# Altium schematic sheet PCI long card 5V - 32 BIT.schdoc: PCI long card 5V - 32 BIT
size A; Organization: Organization; Address1: Address1; Address2: Address2; Address3: Address3; Address4: Address4; DocumentNumber: 1; Revision: 0; SheetNumber: 2; SheetTotal: 2
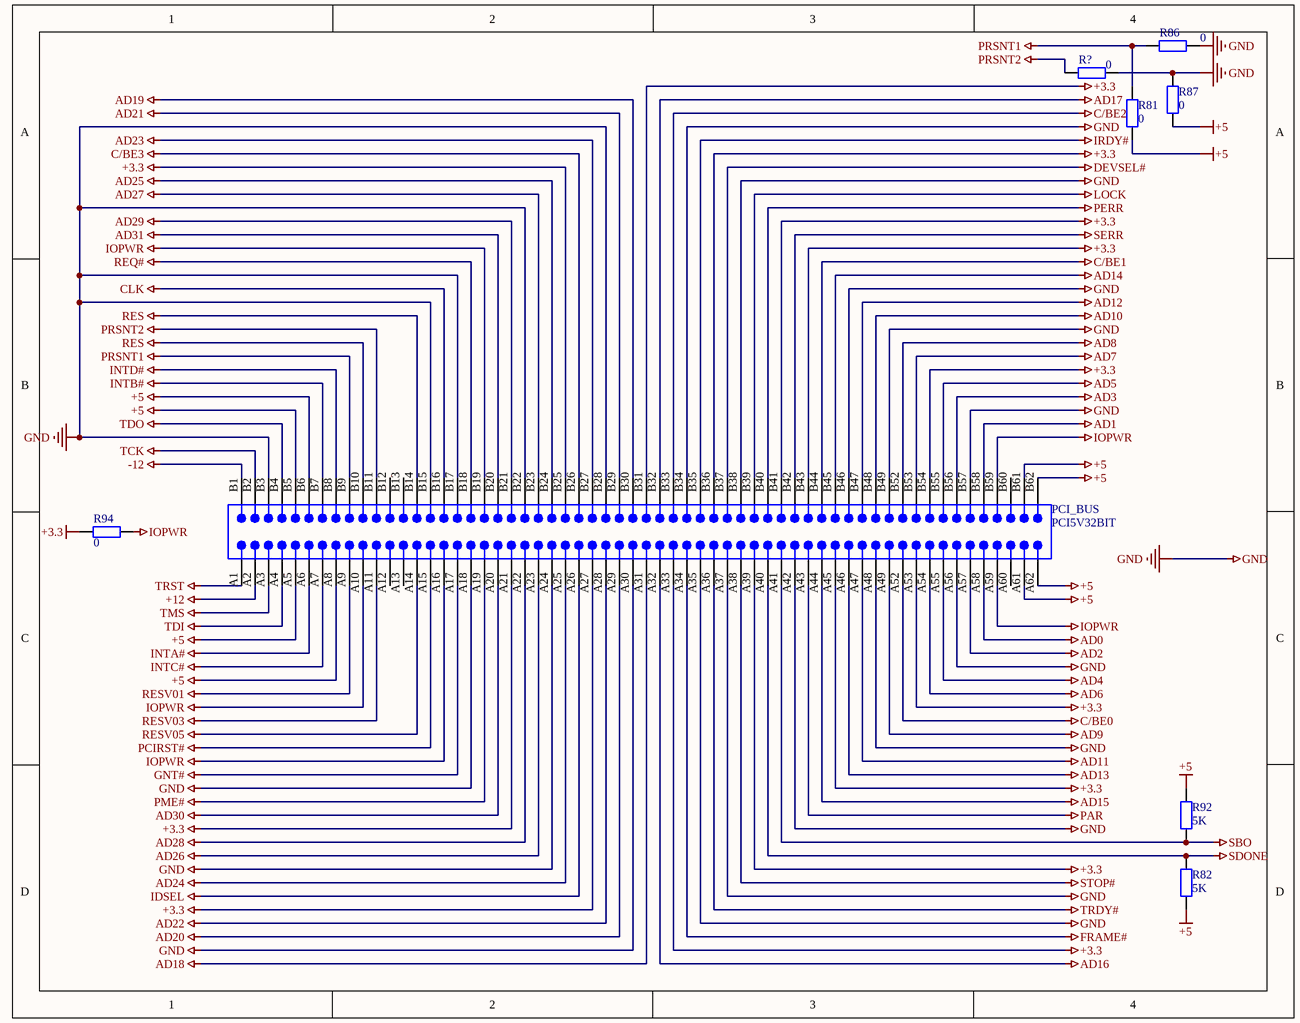
[diagram p0: PCI long card 5V - 32 BIT.schdoc]

## Parts
PCI_BUS  PCI5V32BIT  [PCI5V32BIT]
R81  value 0  [AXIAL-0.4]  (hidden comment: Res2)
R82  value 5K  [AXIAL-0.4]  (hidden comment: Res2)
R86  value 0  [AXIAL-0.4]  (hidden comment: Res2)
R87  value 0  [AXIAL-0.4]  (hidden comment: Res2)
R92  value 5K  [AXIAL-0.4]  (hidden comment: Res2)
R94  value 0  [AXIAL-0.4]  (hidden comment: Res2)
R?  value 0  [AXIAL-0.4]  (hidden comment: Res2)

## Nets
+3.3: PCI_BUS.A21 PCI_BUS.A27 PCI_BUS.A33 PCI_BUS.A39 PCI_BUS.A45 PCI_BUS.A53 PCI_BUS.B25 PCI_BUS.B31 PCI_BUS.B36 PCI_BUS.B41 PCI_BUS.B43 PCI_BUS.B54 R94.1
+5: PCI_BUS.A5 PCI_BUS.A8 PCI_BUS.A61 PCI_BUS.A62 PCI_BUS.B5 PCI_BUS.B6 PCI_BUS.B61 PCI_BUS.B62 R81.2 R82.2 R87.2 R92.1
+12: PCI_BUS.A2
-12: PCI_BUS.B1
AD0: PCI_BUS.A58
AD1: PCI_BUS.B58
AD2: PCI_BUS.A57
AD3: PCI_BUS.B56
AD4: PCI_BUS.A55
AD5: PCI_BUS.B55
AD6: PCI_BUS.A54
AD7: PCI_BUS.B53
AD8: PCI_BUS.B52
AD9: PCI_BUS.A49
AD10: PCI_BUS.B48
AD11: PCI_BUS.A47
AD12: PCI_BUS.B47
AD13: PCI_BUS.A46
AD14: PCI_BUS.B45
AD15: PCI_BUS.A44
AD16: PCI_BUS.A32
AD17: PCI_BUS.B32
AD18: PCI_BUS.A31
AD19: PCI_BUS.B30
AD20: PCI_BUS.A29
AD21: PCI_BUS.B29
AD22: PCI_BUS.A28
AD23: PCI_BUS.B27
AD24: PCI_BUS.A25
AD25: PCI_BUS.B24
AD26: PCI_BUS.A23
AD27: PCI_BUS.B23
AD28: PCI_BUS.A22
AD29: PCI_BUS.B21
AD30: PCI_BUS.A20
AD31: PCI_BUS.B20
C/BE0: PCI_BUS.A52
C/BE1: PCI_BUS.B44
C/BE2: PCI_BUS.B33
C/BE3: PCI_BUS.B26
CLK: PCI_BUS.B16
DEVSEL#: PCI_BUS.B37
FRAME#: PCI_BUS.A34
GND: PCI_BUS.A18 PCI_BUS.A24 PCI_BUS.A30 PCI_BUS.A35 PCI_BUS.A37 PCI_BUS.A42 PCI_BUS.A48 PCI_BUS.A56 PCI_BUS.B3 PCI_BUS.B15 PCI_BUS.B17 PCI_BUS.B22 PCI_BUS.B28 PCI_BUS.B34 PCI_BUS.B38 PCI_BUS.B46 PCI_BUS.B49 PCI_BUS.B57 R86.2 R87.1 R?.2
GNT#: PCI_BUS.A17
IDSEL: PCI_BUS.A26
INTA#: PCI_BUS.A6
INTB#: PCI_BUS.B7
INTC#: PCI_BUS.A7
INTD#: PCI_BUS.B8
IOPWR: PCI_BUS.A10 PCI_BUS.A16 PCI_BUS.A59 PCI_BUS.B19 PCI_BUS.B59 R94.2
IRDY#: PCI_BUS.B35
LOCK: PCI_BUS.B39
PAR: PCI_BUS.A43
PCIRST#: PCI_BUS.A15
PERR: PCI_BUS.B40
PME#: PCI_BUS.A19
PRSNT1: PCI_BUS.B9 R81.1 R86.1
PRSNT2: PCI_BUS.B11 R?.1
REQ#: PCI_BUS.B18
RES: PCI_BUS.B10 PCI_BUS.B14
RESV01: PCI_BUS.A9
RESV03: PCI_BUS.A11
RESV05: PCI_BUS.A14
SBO: PCI_BUS.A41 R92.2
SDONE: PCI_BUS.A40 R82.1
SERR: PCI_BUS.B42
STOP#: PCI_BUS.A38
TCK: PCI_BUS.B2
TDI: PCI_BUS.A4
TDO: PCI_BUS.B4
TMS: PCI_BUS.A3
TRDY#: PCI_BUS.A36
TRST: PCI_BUS.A1

Not connected (* = marked no-connect by the designer): PCI_BUS A12 A13 A60 B12 B13 B60

## Library data of the parts
PCI_BUS = PCI5V32BIT: Card, 120-Position; Text Field6: Pins A50, A51, B50 & B51 are not present.  Alternate Layout Available; Text Field7: Published 14-Feb-2002
R81 R82 R86 R87 R92 R94 R? = Res2: Resistor; Published: 8-Jun-2000; LatestRevisionDate: 17-Jul-2002; LatestRevisionNote: Re-released for DXP Platform.; PackageReference: AXIAL-0.4; Publisher: Altium Limited; PackageDescription: Axial Device, Thru-Hole; 2 Leads; 0.4 in Pin Spacing